# EAGLE design LightBoard (EAGLE 6.5.0)
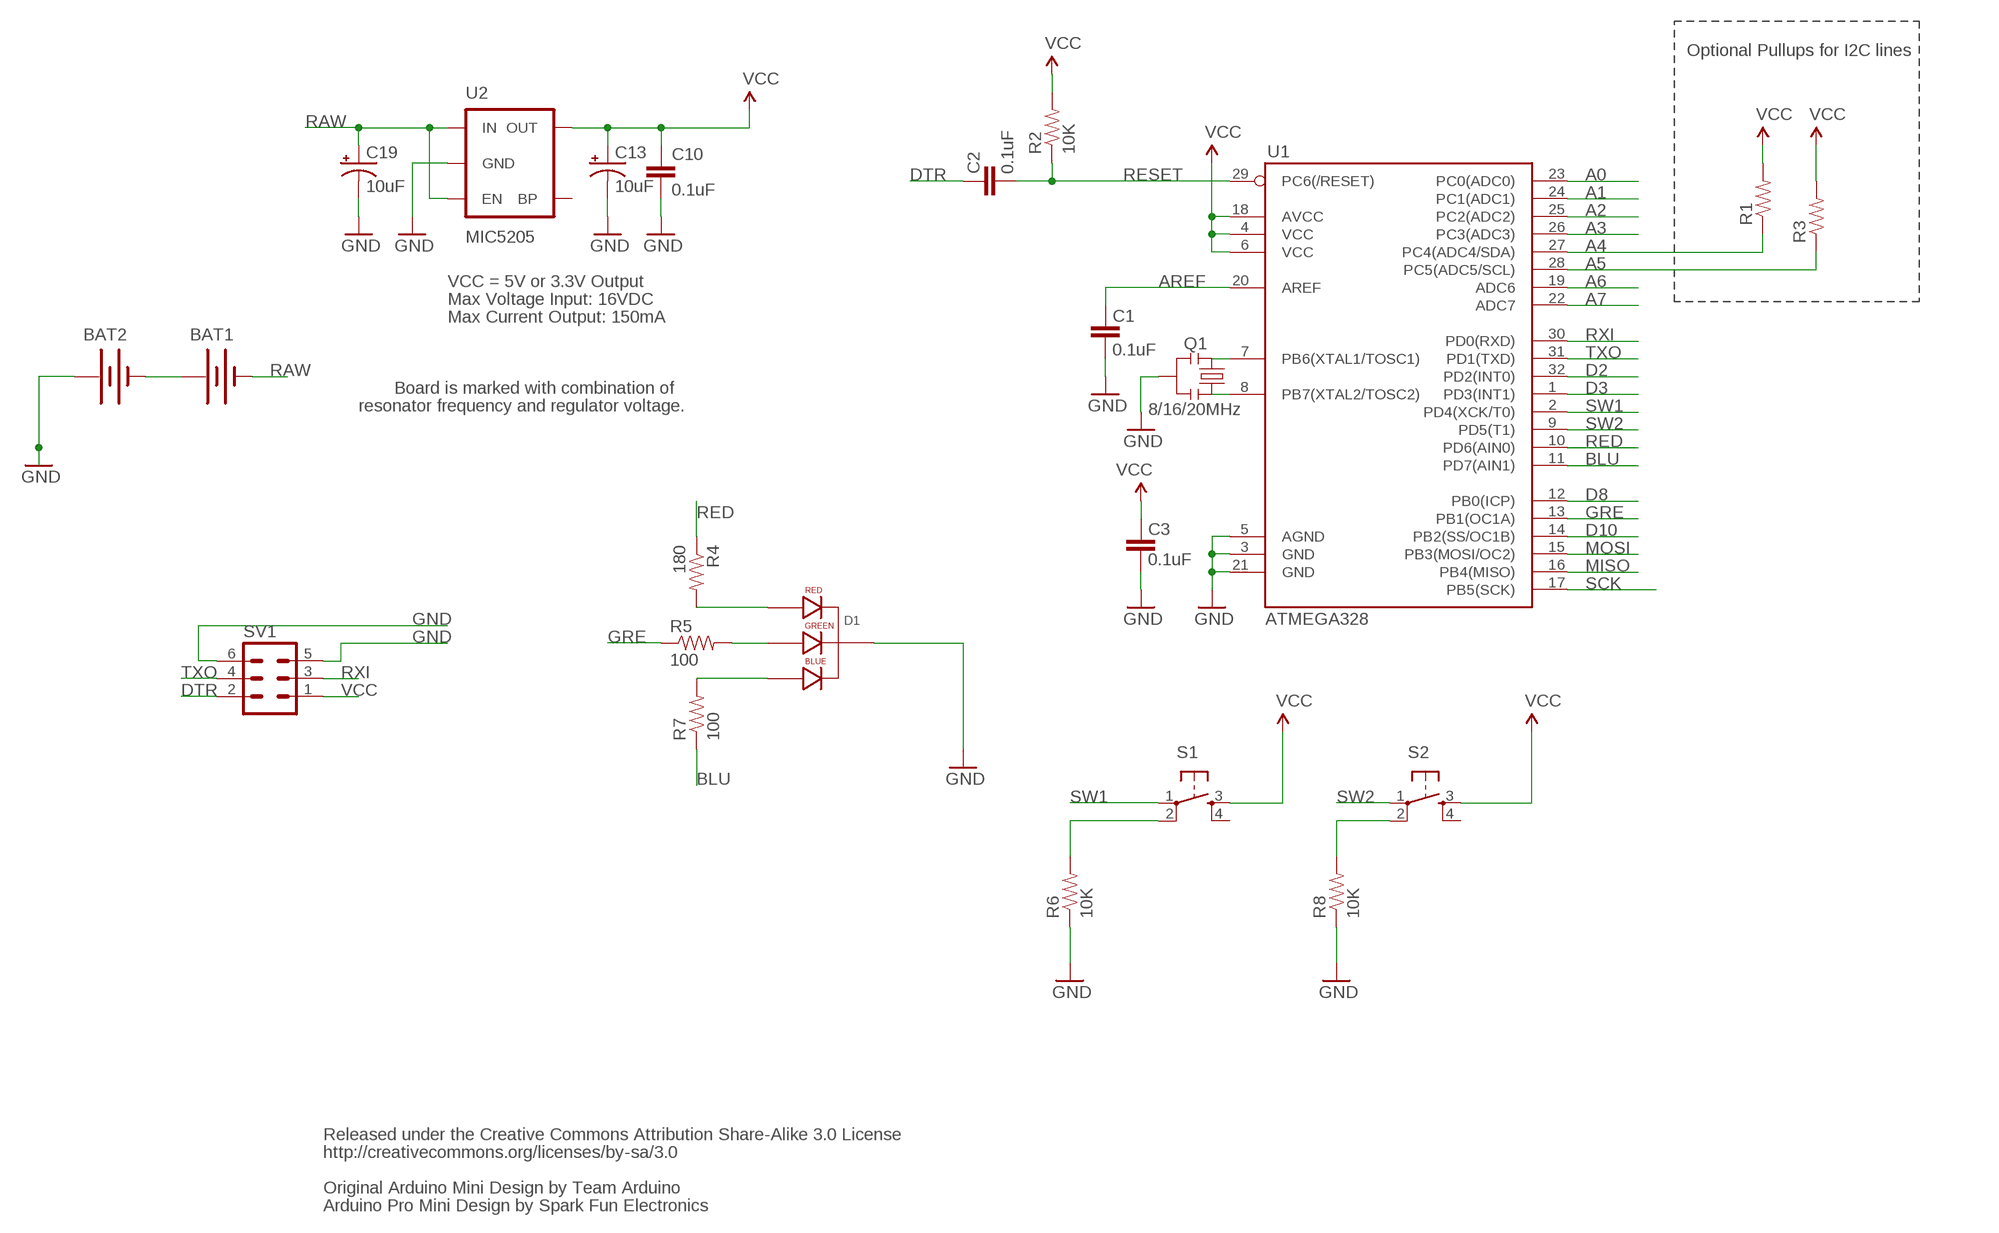
[diagram p0: schematic, sheet 1]

## Parts
BAT1  BATTERY12MM  [BATTCON_12MM]
BAT2  BATTERY12MM  [BATTCON_12MM]
C1  0.1uF  CAP0402-CAP  [0402-CAP]
C2  0.1uF  CAP0402-CAP  [0402-CAP]
C3  0.1uF  CAP0402-CAP  [0402-CAP]
C10  0.1uF  CAP0402-CAP  [0402-CAP]
C13  10uF  CAP_POL1206  [EIA3216]
C19  10uF  CAP_POL1206  [EIA3216]
D1  LED-RGB-CC-THRUDIFFUSE  [LED-RGB-THRU]
Q1  8/16/20MHz  RESONATORSMD  [RESONATOR-SMD]
R1  RESISTOR0402-RES  [0402-RES]
R2  10K  RESISTOR0402-RES  [0402-RES]
R3  RESISTOR0402-RES  [0402-RES]
R4  180  RESISTOR0402-RES  [0402-RES]
R5  100  RESISTOR0402-RES  [0402-RES]
R6  10K  RESISTOR0402-RES  [0402-RES]
R7  100  RESISTOR0402-RES  [0402-RES]
R8  10K  RESISTOR0402-RES  [0402-RES]
S1  TAC_SWITCHPTH  [TACTILE-PTH]
S2  TAC_SWITCHPTH  [TACTILE-PTH]
SV1  MA03-2  [MA03-2]
U1  ATMEGA328  ATMEGA168  [TQFP32-08]
U2  MIC5205  V_REG_LDOSMD  [SOT23-5]

## Nets
A0: U1.23(PC0(ADC0))
A1: U1.24(PC1(ADC1))
A2: U1.25(PC2(ADC2))
A3: U1.26(PC3(ADC3))
A4: R1.1 U1.27(PC4(ADC4/SDA))
A5: R3.1 U1.28(PC5(ADC5/SCL))
A6: U1.19(ADC6)
A7: U1.22(ADC7)
AREF: C1.2 U1.20(AREF)
BLU: R7.1 U1.11(PD7(AIN1))
D2: U1.32(PD2(INT0))
D3: U1.1(PD3(INT1))
D8: U1.12(PB0(ICP))
D10: U1.14(PB2(SS/OC1B))
DTR: C2.2 SV1.2
GND [vcc]: BAT2.PWR@1(+) C1.1 C3.1 C10.2 C13.C(-) C19.C(-) D1.2(CATHODE) Q1.2 R6.1 R8.1 SV1.5 SV1.6 U1.3(GND) U1.5(AGND) U1.21(GND) U2.2(GND)
GRE: R5.1 U1.13(PB1(OC1A))
MISO: U1.16(PB4(MISO))
MOSI: U1.15(PB3(MOSI/OC2))
N$1: Q1.1 U1.8(PB7(XTAL2/TOSC2))
N$2: Q1.3 U1.7(PB6(XTAL1/TOSC1))
N$3: BAT1.PWR@1(+) BAT2.GND(-)
N$4: D1.1(RED_CATHODE) R4.2
N$5: D1.3(GREEN_CATHODE) R5.2
N$6: D1.4(BLUE_CATHODE) R7.2
N$7 [vcc]: R6.2 S1.2
N$8 [vcc]: R8.2 S2.2
RAW [vcc]: BAT1.GND(-) C19.A(+) U2.1(IN) U2.3(EN)
RED: R4.1 U1.10(PD6(AIN0))
RESET: C2.1 R2.1 U1.29(PC6(/RESET))
RXI: SV1.3 U1.30(PD0(RXD))
SCK: U1.17(PB5(SCK))
SW1: S1.1 U1.2(PD4(XCK/T0))
SW2: S2.1 U1.9(PD5(T1))
TXO: SV1.4 U1.31(PD1(TXD))
VCC: C3.2 C10.1 C13.A(+) R1.2 R2.2 R3.2 S1.3 S2.3 SV1.1 U1.4(VCC) U1.6(VCC) U1.18(AVCC) U2.5(OUT)
Unconnected: S1.4 S2.4 U2.4(BP)

## Notes on the sheet
- Optional Pullups for I2C lines
- VCC = 5V or 3.3V Output
- Max Voltage Input: 16VDC
- Max Current Output: 150mA
- Board is marked with combination of
- resonator frequency and regulator voltage.
- Released under the Creative Commons Attribution Share-Alike 3.0 License
- http://creativecommons.org/licenses/by-sa/3.0
- Original Arduino Mini Design by Team Arduino
- Arduino Pro Mini Design by Spark Fun Electronics

## Library data of the parts
BAT1 BAT2 = SparkFun-Electromechanical:BATTERY: Battery Holders Various common sizes : AA, AAA, 20mm coin cell and 12mm coin cell. 20MM_4LEGS, BATT-10373
C1-C3 C10 = SparkFun:CAP: Capacitor Standard 0603 ceramic capacitor, and 0.1" leaded capacitor.
C13 C19 = SparkFun:CAP_POL: Capacitor Polarized These are standard SMD and PTH capacitors. Normally 10uF, 47uF, and 100uF in electrolytic and tantalum varieties. Always verify the external diameter of the through hole cap, it varies with capacity, voltage, and manufacturer. The EIA devices should be standard.
D1 = SparkFun-LED:LED-RGB-CC-THRU: RGB Through-hole common cathode LED SparkFun Storefront: COM-00105 (Clear) COM-09264 (Diffuse); PROD_ID: DIO-09434
Q1 = SparkFun:RESONATOR: Resonator Small SMD resonator. This is the itty bitty 10/20MHz resonators with built in caps. CSTCE10M0G55 and CSTCE20M0V53. Footprint has been reviewed closely but hasn't been tested yet.
R1-R3 = SparkFun:RESISTOR: Resistor Basic schematic elements and footprints for 0603, 1206, and PTH resistors.
R4-R8 = SparkFun-Passives:RESISTOR: Resistor Basic schematic elements and footprints for 0603, 1206, and PTH resistors.
S1 S2 = SparkFun-Electromechanical:TAC_SWITCH: Momentary Switch Button commonly used for reset or general input. Spark Fun Electronics SKU : COM-00097 SMT- SWCH-08247
SV1 = con-lstb:MA03-2: PIN HEADER; OC_FARNELL: unknown; OC_NEWARK: unknown
U1 = SparkFun:ATMEGA168
U2 = SparkFun:V_REG_LDO: Voltage Regulator LDO Standard 150mA LDO voltage regulator in SOT-23 layout. Micrel part MIC5205. BP (by-pass) pin is used to lower output noise with 470pF cap.

## Net classes
0 default: width 0.203 mm
1 vcc: width 0.254 mm

## Board
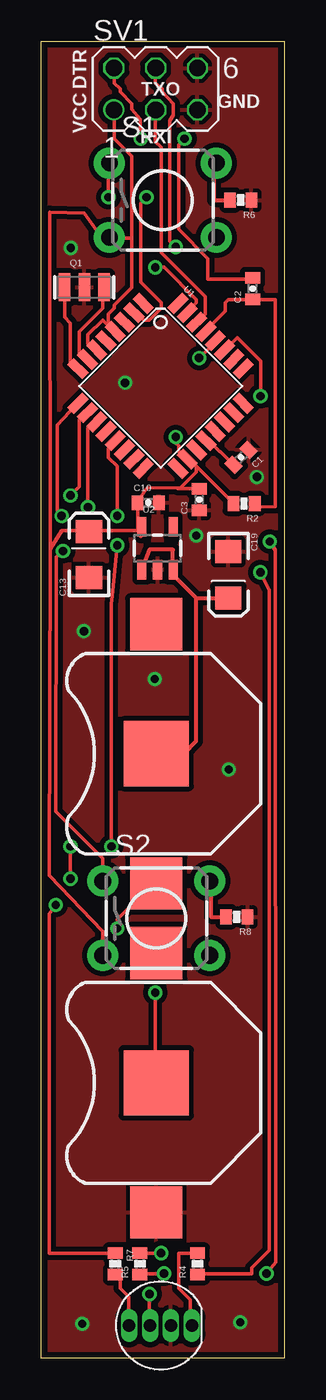
[diagram p1: board, top side]
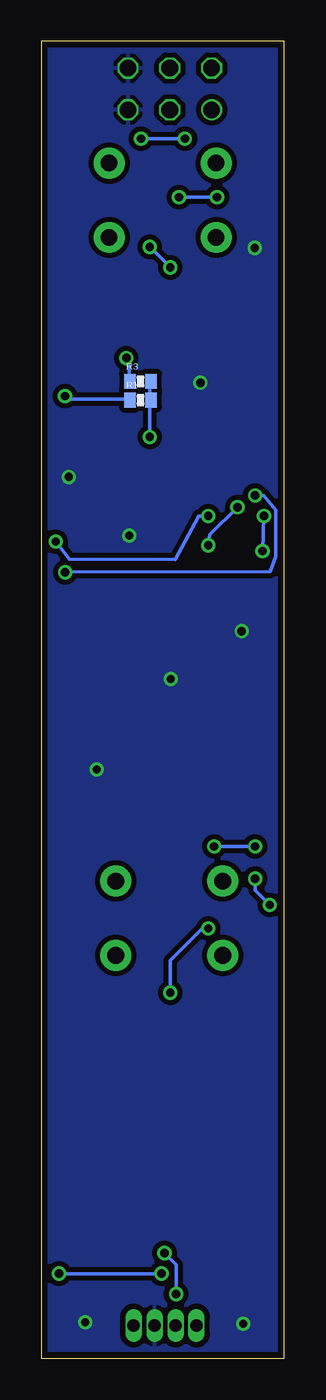
[diagram p2: board, bottom side, seen from below]

Size 14.78 x 80.07 mm. Coordinates in mm from the lower left corner, seen from the top.
Outline: 0,0 0,80.07 14.78,80.07 14.78,0 0,0
Copper layers (1*16): Top 0.0356mm / dielectric 1.5011mm / Bottom 0.0356mm
Design rules "LaenPCBOrder *": minimum track width 6mil, minimum drill 13mil, track to track 6mil, track to pad 6mil, pad to pad 6mil, via to via 6mil, smd to smd 6mil, copper to edge 15mil, drill to drill 6mil, minimum pad ring 5mil, minimum via ring 7mil, stop-mask expansion 3mil, vias tented up to drill 0mil, thermal gap 10mil

### Footprints (pad centres in the part's own frame; a part is rotated, then mirrored left to right if it is on the bottom)
BATTCON_12MM = smd 3.962 x 3.962: GND 0,0 | smd 3.175 x 3.175: PWR@1 -7.874,0; PWR@2 7.874,0
0402-CAP = smd 0.7 x 0.9: 1 -0.65,0; 2 0.65,0
EIA3216 = smd 1.4 x 1.6: A 1.4,0; C -1.4,0
LED-RGB-THRU = drill 0.762 pad 0.889 long: 1 1.905,0; 2 0.635,0; 3 -0.635,0; 4 -1.905,0
RESONATOR-SMD = smd 0.7 x 1.7: 1 -1.2,0; 2 0,0; 3 1.2,0
0402-RES = smd 0.7 x 0.9: 1 -0.65,0; 2 0.65,0
TACTILE-PTH = drill 1.016 pad 1.88: 1 -3.251,2.261; 2 3.251,2.261; 3 -3.251,-2.261; 4 3.251,-2.261
MA03-2 = drill 1.016: 1 -2.54,-1.27 | drill 1.016 octagon: 2 -2.54,1.27; 3 0,-1.27; 4 0,1.27; 5 2.54,-1.27; 6 2.54,1.27
TQFP32-08 = smd 1.27 x 0.559: 1 -4.293,2.8; 2 -4.293,2; 3 -4.293,1.2; 4 -4.293,0.4; 5 -4.293,-0.4; 6 -4.293,-1.2; 7 -4.293,-2; 8 -4.293,-2.8; 17 4.293,-2.8; 18 4.293,-2; 19 4.293,-1.2; 20 4.293,-0.4; 21 4.293,0.4; 22 4.293,1.2; 23 4.293,2; 24 4.293,2.8 | smd 0.559 x 1.27: 9 -2.8,-4.293; 10 -2,-4.293; 11 -1.2,-4.293; 12 -0.4,-4.293; 13 0.4,-4.293; 14 1.2,-4.293; 15 2,-4.293; 16 2.8,-4.293; 25 2.8,4.293; 26 2,4.293; 27 1.2,4.293; 28 0.4,4.293; 29 -0.4,4.293; 30 -1.2,4.293; 31 -2,4.293; 32 -2.8,4.293
SOT23-5 = smd 0.55 x 1.2: 1 -0.95,-1.3; 2 0,-1.3; 3 0.95,-1.3; 4 0.95,1.3; 5 -0.95,1.3

### Placement (x,y rotation side)
BAT1  7,36.75 90 top
BAT2  7,16.75 90 top
C1  12.15,54.77 225 top
C2  12.85,65.03 90 top
C3  9.61,52.21 90 top
C10  6.5,52.01 0 top
C13  2.9,48.87 90 top
C19  11.37,47.63 270 top
D1  7.25,2 0 top
Q1  2.62,65.11 0 top
R1  8.75,58.25 0 bottom
R2  12.33,51.96 180 top
R3  8.75,59.39 0 bottom
R4  9.5,5.75 90 top
R5  6,5.75 90 top
R6  12.13,70.41 180 top
R7  4.5,5.75 270 top
R8  11.89,26.84 180 top
S1  7.4,70.4 0 top
S2  7,26.75 0 top
SV1  6.96,77.16 0 top
U1  7.26,59.11 315 top
U2  7.07,49.24 0 top

### Tracks (layer width: path | path; a pad name or v marks a point on that pad's centre or on a via)
A4  (via drill 0.51)
  Top 0.203: v13.34,58.5 13.34,60.63 11.91,62.05 11.2,61.34 U1.27
  Bottom 0.203: v13.34,58.5 13.16,58.32 9.42,58.32 R1.1
A5  (via drill 0.51)
  Top 0.203: v9.6,60.81 10.49,61.7 U1.28
  Bottom 0.203: v9.6,60.81 9.42,60.63 9.42,59.56 R3.1
AREF
  Top 0.203: C1.2 11.09,54.9 10.88,55.11 10.85,55.12 10.13,55.83 U1.20
BLU  (via drill 0.51)
  Top 0.203: v0.89,27.56 0.5,27.03 0.5,6.4 4.45,6.4 R7.1 | v1.78,31.11 v1.78,29.16 | v4.27,31.11 4.27,45.87 4.32,46.33 v4.62,49.43 | v2.85,51.74 2.85,56.54 3.2,56.9 U1.11
  Bottom 0.203: v0.89,27.56 1.78,28.45 v1.78,29.16 | v4.27,31.11 v1.78,31.11 | v4.62,49.43 4.52,50.06 v2.85,51.74
DTR  (via drill 0.51)
  Top 0.203: v8.71,74.14 8.36,73.79 8.36,68.63 10.13,66.85 10.13,65.61 12.8,65.61 C2.2 | v6.04,74.14 6.03,75.34 5.51,75.92 5.51,76.28 4.8,76.99 4.8,77.17 4.45,77.52 4.45,78.41 SV1.2
  Bottom 0.203: v6.04,74.14 v8.71,74.14
GND  (via drill 0.5 pad 0.25)
  other vias: 1.8,67.5 5.1,59.3 2.6,44.2 11.4,35.8 2.5,2.1 12.1,2.2 6.9,41.3 13.11,53.58 9.43,50.01
  pour Top (isolate 0.305): 0,80.07 14.78,80.07 14.78,0 0,0
  pour Bottom (isolate 0.305): 0,80.07 14.78,80.07 14.78,0 0,0
GRE  (via drill 0.51)
  Top 0.203: v7.47,5.16 6.04,5.16 R5.1 | v13.69,5.16 14.25,5.85 14.21,49.14 v13.89,49.65 | v4.62,51.21 4.62,54.23 4.09,54.76 4.09,55.3 4.45,55.65 U1.13
  Bottom 0.203: v13.69,5.16 v7.47,5.16 | v13.89,49.65 13.06,48.6 6.62,48.57 5.19,51.21 v4.62,51.21
N$1
  Top 0.203: U1.8 2.13,60.27 1.96,60.27 1.78,60.45 1.78,62.94 1.42,63.3 1.42,65.08 Q1.1
N$2
  Top 0.203: U1.7 2.67,60.81 2.49,60.81 2.31,60.98 2.31,62.41 3.73,63.83 3.73,65.08 Q1.3
N$3  (via drill 0.51)
  Top 0.203: v4.62,26.14 4.62,26.67 5.51,27.56 5.51,28.8 6.93,28.8 BAT1.PWR@1 | v6.93,22.23 6.93,16.89 BAT2.GND
  Bottom 0.203: v4.62,26.14 4.98,26.14 6.93,24.18 v6.93,22.23
N$4
  Top 0.203: R4.2 9.42,6.4 8.36,6.4 8.36,4.27 9.07,3.56 9.07,2.13 D1.1
N$5  (via drill 0.51)
  Top 0.203: v6.58,3.91 6.58,2.13 D1.3 | v7.29,6.4 6.04,6.4 R5.2
  Bottom 0.203: v6.58,3.91 6.58,5.69 v7.29,6.4
N$6
  Top 0.203: R7.2 4.62,4.98 4.8,4.8 4.8,4.27 5.33,3.73 5.33,2.13 D1.4
N$7
  Top 0.254: R6.2 10.49,70.41 10.49,71.83 10.67,72.01 10.67,72.54 S1.2
N$8
  Top 0.254: R8.2 10.31,26.85 10.31,28.98 S2.2
RAW
  Top 0.254: U2.1 6.04,47.47 6.04,47.83 6.58,49.16 8,49.16 8,47.47 U2.3 8.18,47.47 9.42,46.23 | 9.42,46.23 11.2,46.23 C19.A | 9.42,46.23 9.42,37.52 8.71,36.8 7.11,36.8 BAT1.GND
RED  (via drill 0.51)
  Top 0.203: v13.32,47.78 13.86,46.7 13.87,6.58 12.8,5.51 12.8,5.16 9.6,5.16 R4.1 | v1.78,52.45 2.31,52.98 2.31,57.07 2.67,57.43 U1.10
  Bottom 0.203: v13.32,47.78 0.87,47.82 0.52,48.73 0.52,51.57 1.25,52.45 v1.78,52.45
RESET
  Top 0.203: R2.1 12.99,51.74 14.22,51.77 14.22,64.22 14.22,64.36 12.98,64.36 C2.1 12.8,64.36 11.38,64.36 11.2,64.19 11.2,63.65 10.13,62.59 U1.29
RXI
  Top 0.203: U1.30 9.6,63.12 9.96,63.48 9.96,64.54 7.29,67.21 7.29,73.61 6.93,73.97 6.93,75.74 SV1.3
SW1  (via drill 0.51)
  Top 0.203: v6.4,70.59 6.04,70.23 6.04,65.43 7.29,64.19 7.29,63.83 6.58,63.12 6.22,63.12 5.87,63.48 5.69,63.48 U1.2 | v4.09,70.59 4.09,72.54 S1.1
  Bottom 0.203: v4.09,70.59 v6.4,70.59
SW2  (via drill 0.51)
  Top 0.203: v1.25,51.21 0.97,51.56 0.97,56.72 2.13,57.96 U1.9 | v1.32,49.07 0.93,48.72 0.89,33.25 3.73,30.4 3.73,29.16 S2.1
  Bottom 0.203: v1.32,49.07 v1.25,51.21
TXO  (via drill 0.51)
  Top 0.203: v6.93,66.32 7.47,66.32 9.42,64.36 9.42,64.19 8.89,63.65 U1.31 | v8.18,67.56 7.82,67.92 7.82,75.23 8.04,75.56 8.04,76.28 7.37,77 7.37,77.17 6.93,77.52 6.93,78.41 SV1.4
  Bottom 0.203: v8.18,67.56 v6.93,66.32
VCC  (via drill 0.51)
  Top 0.203: 5.51,68.1 5.51,65.08 4.45,64.01 4.45,63.83 4.09,63.48 4.09,62.76 | 5.51,68.1 5.51,73.08 4.45,74.14 4.45,75.74 SV1.1 | 4.09,62.76 4.45,62.41 U1.4 4.09,62.76 | 4.09,62.76 3.73,63.12 2.85,62.23 2.85,61.7 3.2,61.34 U1.6 | 5.51,68.1 4.27,68.1 S1.3 4.09,68.1 4.09,67.56 2.63,69.61 0.54,69.67 0.56,49.2 | 5.87,50.67 5.87,51.92 C10.1 5.87,52.09 6.37,52.81 6.48,52.93 8.32,52.91 8.47,52.92 | 5.87,50.67 6.04,50.49 6.04,49.96 U2.5 | 5.87,50.67 5.87,50.32 3.2,50.32 C13.A 3.02,50.32 1.25,50.32 0.56,49.2 | 8.47,52.92 8.3,52.88 C3.2 | 8.47,52.92 9.42,53.87 9.42,54.23 | 9.42,54.23 8.89,54.76 U1.18 8.71,54.59 8.53,54.76 8.53,54.94 8.36,55.12 8.36,55.47 8.18,55.65 v8.18,56.01 | 9.42,54.23 10.49,53.16 11.61,52.05 R2.2 | 0.56,49.2 0.49,29.36 3.73,25.96 3.73,24.54 S2.3
  Bottom 0.203: R3.2 8.18,59.38 8.18,58.32 R1.2 8.18,58.14 v8.18,56.01

### Text on the board
tPlace: DTR | TXO | GND | VCC | RXI
tValues: Valid combinations: | 168V / 3.3V Reg / 8MHz | 168 / 5V Reg / 16MHz | 168 / 5V Reg / 20MHz | Mark back accordingly | Arduino Pro Mini